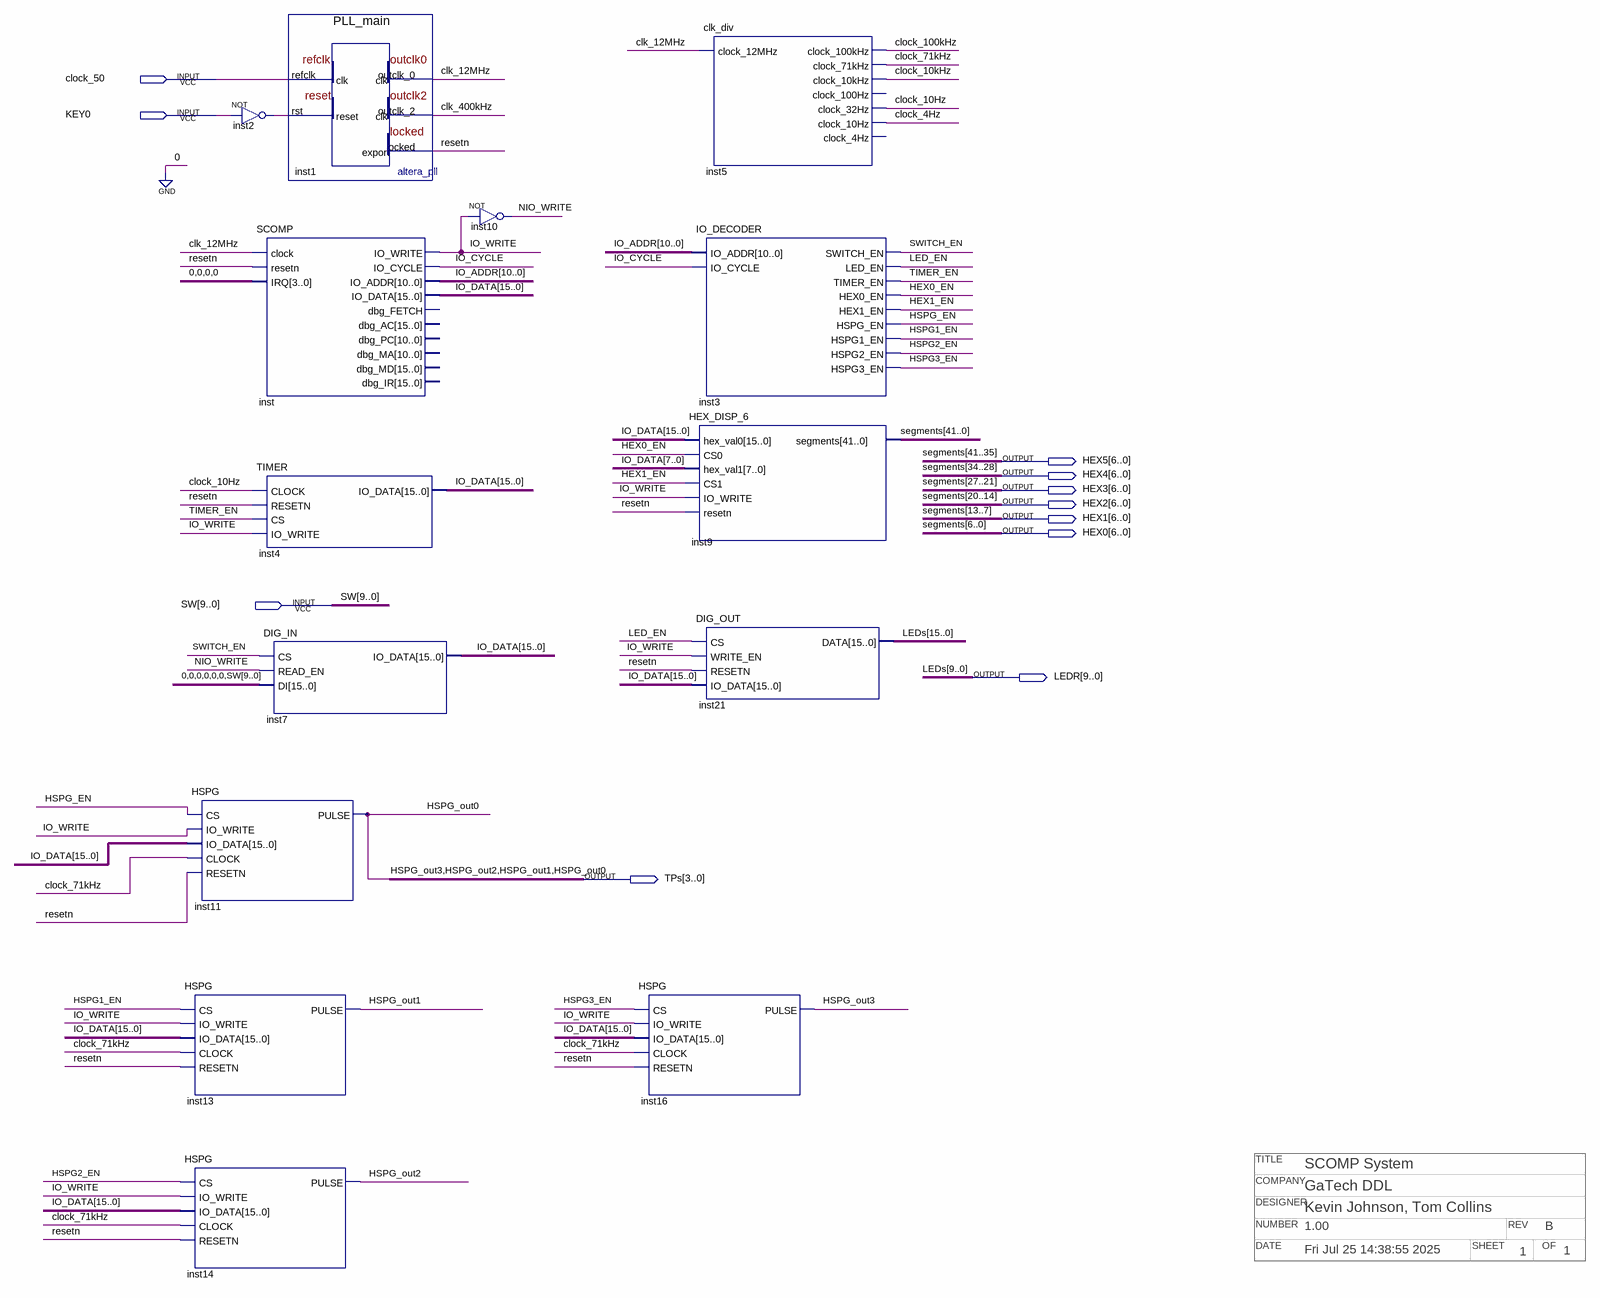
[diagram p0: schematic sheet]
// Quartus schematic SCOMP_System.bdf as structural Verilog: 14 symbols, 11 pins
// Title block: COMPANY: GaTech DDL; DATE: Fri Jul 25 14:38:55 2025; DESIGNER: Kevin Johnson, Tom Collins; NUMBER: 1.00; OF: 1; REV: B; SHEET: 1; TITLE: SCOMP System
module SCOMP_System (
  input  clock_50,
  input  KEY0,
  input  [9:0] SW,
  output [6:0] HEX5,
  output [6:0] HEX4,
  output [6:0] HEX3,
  output [6:0] HEX2,
  output [6:0] HEX1,
  output [6:0] HEX0,
  output [9:0] LEDR,
  output [3:0] TPs
);

  wire clk_12MHz, clk_400kHz, clock_4Hz, clock_10Hz, clock_10kHz, clock_71kHz, clock_100kHz, HEX0_EN,
       HEX1_EN, HSPG1_EN, HSPG2_EN, HSPG3_EN, HSPG_EN, inst2_out, IO_CYCLE, IO_WRITE, LED_EN, NIO_WRITE,
       resetn, SWITCH_EN, TIMER_EN;
  wire [10:0] IO_ADDR;
  wire [15:0] IO_DATA;
  wire [15:10] LEDs;

  HSPG inst11 (
    .CS(HSPG_EN), .IO_WRITE(IO_WRITE), .IO_DATA(IO_DATA), .CLOCK(clock_71kHz), .RESETN(resetn), .PULSE(TPs[0]));
  HSPG inst13 (
    .CS(HSPG1_EN), .IO_WRITE(IO_WRITE), .IO_DATA(IO_DATA), .CLOCK(clock_71kHz), .RESETN(resetn),
    .PULSE(TPs[1]));
  HSPG inst14 (
    .CS(HSPG2_EN), .IO_WRITE(IO_WRITE), .IO_DATA(IO_DATA), .CLOCK(clock_71kHz), .RESETN(resetn),
    .PULSE(TPs[2]));
  not inst2 (inst2_out, KEY0);
  SCOMP inst (
    .clock(clk_12MHz), .resetn(resetn), .IRQ(4'b0000), .IO_WRITE(IO_WRITE), .IO_CYCLE(IO_CYCLE),
    .IO_ADDR(IO_ADDR), .IO_DATA(IO_DATA));  // open: dbg_FETCH, dbg_AC, dbg_PC, dbg_MA, dbg_MD, dbg_IR
  TIMER inst4 (.CLOCK(clock_10Hz), .RESETN(resetn), .CS(TIMER_EN), .IO_WRITE(IO_WRITE), .IO_DATA(IO_DATA));
  DIG_IN inst7 (.CS(SWITCH_EN), .READ_EN(NIO_WRITE), .DI({{6{1'b0}}, SW}), .IO_DATA(IO_DATA));
  PLL_main inst1 (.refclk(clock_50), .rst(inst2_out), .outclk_0(clk_12MHz), .outclk_2(clk_400kHz), .locked(resetn));
  not inst10 (NIO_WRITE, IO_WRITE);
  HSPG inst16 (
    .CS(HSPG3_EN), .IO_WRITE(IO_WRITE), .IO_DATA(IO_DATA), .CLOCK(clock_71kHz), .RESETN(resetn),
    .PULSE(TPs[3]));
  clk_div inst5 (
    .clock_12MHz(clk_12MHz), .clock_100kHz(clock_100kHz), .clock_71kHz(clock_71kHz),
    .clock_10kHz(clock_10kHz), .clock_32Hz(clock_10Hz), .clock_10Hz(clock_4Hz));  // open: clock_100Hz, clock_4Hz
  IO_DECODER inst3 (
    .IO_ADDR(IO_ADDR), .IO_CYCLE(IO_CYCLE), .SWITCH_EN(SWITCH_EN), .LED_EN(LED_EN), .TIMER_EN(TIMER_EN),
    .HEX0_EN(HEX0_EN), .HEX1_EN(HEX1_EN), .HSPG_EN(HSPG_EN), .HSPG1_EN(HSPG1_EN), .HSPG2_EN(HSPG2_EN),
    .HSPG3_EN(HSPG3_EN));
  HEX_DISP_6 inst9 (
    .hex_val0(IO_DATA), .CS0(HEX0_EN), .hex_val1(IO_DATA[7:0]), .CS1(HEX1_EN), .IO_WRITE(IO_WRITE),
    .resetn(resetn), .segments({HEX5, HEX4, HEX3, HEX2, HEX1, HEX0}));
  DIG_OUT inst21 (.CS(LED_EN), .WRITE_EN(IO_WRITE), .RESETN(resetn), .IO_DATA(IO_DATA), .DATA({LEDs, LEDR}));

  // Other names for the same wires on the sheet: HSPG_out0 = TPs[0]; HSPG_out1 = TPs[1]; HSPG_out2 = TPs[2];
  //   HSPG_out3 = TPs[3]; LEDs[9:0] = LEDR; segments[41:0] = {HEX5, HEX4, HEX3, HEX2, HEX1, HEX0}
endmodule
